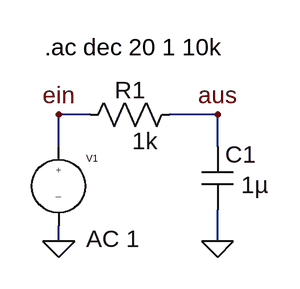
[diagram p0: schematic rc-tiefpass.asc]
rc-tiefpass.asc, the LTspice schematic file:
Version 4
SHEET 1 880 680
WIRE 128 144 96 144
WIRE 256 144 208 144
WIRE 96 176 96 144
WIRE 256 176 256 144
WIRE 96 272 96 256
WIRE 256 272 256 240
FLAG 256 272 0
FLAG 96 272 0
FLAG 256 144 aus
FLAG 96 144 ein
SYMBOL res 112 160 R270
WINDOW 0 25 56 VTop 2
WINDOW 3 5 71 VBottom 2
SYMATTR InstName R1
SYMATTR Value 1k
SYMBOL cap 240 176 R0
WINDOW 3 40 39 Left 2
SYMATTR InstName C1
SYMATTR Value 1µ
SYMBOL source-V 96 160 R0
WINDOW 123 28 109 Left 2
WINDOW 39 0 0 Left 2
SYMATTR InstName V1
SYMATTR Value ""
SYMATTR Value2 AC 1
TEXT 82 76 Left 2 !.ac dec 20 1 10k

The netlist it stands for:
* rc-tiefpass.asc
R1 ein aus 1k
C1 aus 0 1µ
V1 ein 0 AC 1
.ac dec 20 1 10k
.backanno
.end